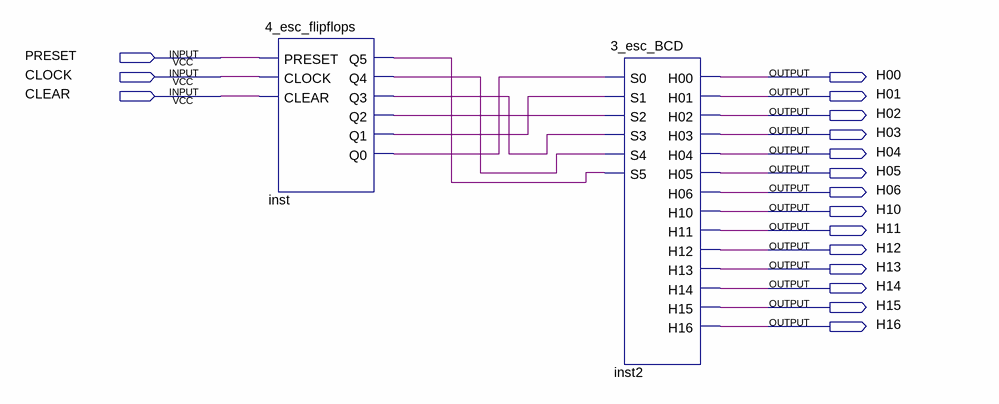
[diagram p0: schematic sheet]
// Quartus schematic 4_esc_flipflops_BCD.bdf as structural Verilog: 2 symbols, 17 pins
module \4_esc_flipflops_BCD  (
  input  PRESET,
  input  CLOCK,
  input  CLEAR,
  output H00,
  output H01,
  output H02,
  output H03,
  output H04,
  output H05,
  output H06,
  output H10,
  output H11,
  output H12,
  output H13,
  output H14,
  output H15,
  output H16
);

  wire inst_q0, inst_q1, inst_q2, inst_q3, inst_q4, inst_q5;

  \4_esc_flipflops  inst (
    .PRESET(PRESET), .CLOCK(CLOCK), .CLEAR(CLEAR), .Q5(inst_q5), .Q4(inst_q4), .Q3(inst_q3), .Q2(inst_q2),
    .Q1(inst_q1), .Q0(inst_q0));
  \3_esc_BCD  inst2 (
    .S0(inst_q0), .S1(inst_q1), .S2(inst_q2), .S3(inst_q3), .S4(inst_q4), .S5(inst_q5), .H00(H00), .H01(H01),
    .H02(H02), .H03(H03), .H04(H04), .H05(H05), .H06(H06), .H10(H10), .H11(H11), .H12(H12), .H13(H13),
    .H14(H14), .H15(H15), .H16(H16));
endmodule
